# Altium schematic sheet Voltage_Rails.SchDoc
size A; SheetNumber: 2; SheetTotal: 5
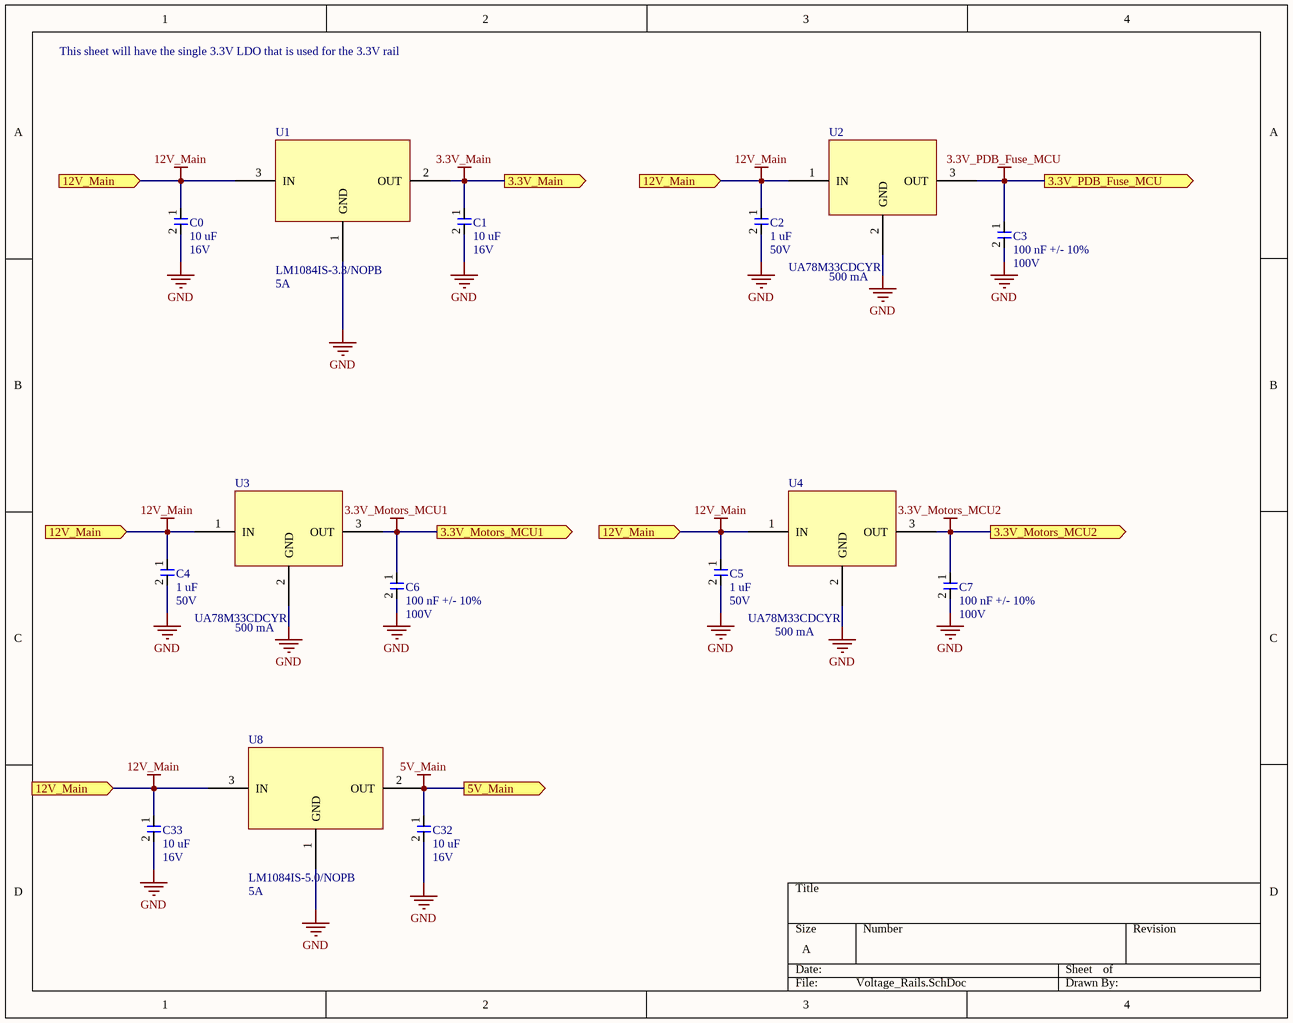
[diagram p0: Voltage_Rails.SchDoc]

## Parts
C0  Capacitance: 10 uF  Voltage Rating: 16V  [CAP-0805]  (hidden comment: CL21A106KOQNNNE)
C1  Capacitance: 10 uF  Voltage Rating: 16V  [CAP-0805]  (hidden comment: CL21A106KOQNNNE)
C2  Capacitance: 1 uF  Voltage: 50V  [CAP-0603]  (hidden comment: UMK107AB7105KA-T)
C3  Capacitance: 100 nF +/- 10%  Voltage: 100V  [CAP-0603]  (hidden comment: CC0603KRX7R0BB104)
C4  Capacitance: 1 uF  Voltage: 50V  [CAP-0603]  (hidden comment: UMK107AB7105KA-T)
C5  Capacitance: 1 uF  Voltage: 50V  [CAP-0603]  (hidden comment: UMK107AB7105KA-T)
C6  Capacitance: 100 nF +/- 10%  Voltage: 100V  [CAP-0603]  (hidden comment: CC0603KRX7R0BB104)
C7  Capacitance: 100 nF +/- 10%  Voltage: 100V  [CAP-0603]  (hidden comment: CC0603KRX7R0BB104)
C32  Capacitance: 10 uF  Voltage Rating: 16V  [CAP-0805]  (hidden comment: CL21A106KOQNNNE)
C33  Capacitance: 10 uF  Voltage Rating: 16V  [CAP-0805]  (hidden comment: CL21A106KOQNNNE)
U1  LM1084IS-3.3/NOPB  Current: 5A  [DDPAK/TO-263-3]
U2  UA78M33CDCYR  Current: 500 mA  [SOT-223-4]
U3  UA78M33CDCYR  Current: 500 mA  [SOT-223-4]
U4  UA78M33CDCYR  Current: 500 mA  [SOT-223-4]
U8  LM1084IS-5.0/NOPB  Current: 5A  [DDPAK/TO-263-3]

## Ports
3.3V_Main (out), 3.3V_Motors_MCU1 (out), 3.3V_Motors_MCU2 (out), 3.3V_PDB_Fuse_MCU (out), 5V_Main (out), 12V_Main (in)

## Nets
3.3V_Main: C1.1 U1.2(OUT) ; port 3.3V_Main
3.3V_Motors_MCU1: C6.1 U3.3(OUT) ; port 3.3V_Motors_MCU1
3.3V_Motors_MCU2: C7.1 U4.3(OUT) ; port 3.3V_Motors_MCU2
3.3V_PDB_Fuse_MCU: C3.1 U2.3(OUT) ; port 3.3V_PDB_Fuse_MCU
5V_Main: C32.1 U8.2(OUT) ; port 5V_Main
12V_Main: C0.1 C2.1 C4.1 C5.1 C33.1 U1.3(IN) U2.1(IN) U3.1(IN) U4.1(IN) U8.3(IN) ; port 12V_Main
GND: C0.2 C1.2 C2.2 C3.2 C4.2 C5.2 C6.2 C7.2 C32.2 C33.2 U1.1(GND) U2.2(GND) U3.2(GND) U4.2(GND) U8.1(GND)

## Notes on the sheet
- This sheet will have the single 3.3V LDO that is used for the 3.3V rail

## Library data of the parts
C0 C1 C32 C33 = CAP-10U-0002: 10 µF ±10% 16V Ceramic Capacitor X7R 0805 (2012 Metric); Package Size: 0805
C2 C4 C5 = CAP-1U-0002: 1 µF ±10% 50V Ceramic Capacitor X7R 0603 (1608 Metric); Package Size: 0603
C3 C6 C7 = CAP-100N-0002-JLC: 100V 100nF X7R ±10% 0603 Multilayer Ceramic Capacitors MLCC - SMD/SMT ROHS; assembled?: yes; JLC Part Number: C113803
U1 = LDO-3.3V-0001: Linear Voltage Regulator IC Positive Fixed 1 Output 5A DDPAK/TO-263-3; Vout (fixed): 3.3V; Vin (max): 27V; Package: DDPAK/TO-263-3
U2-U4 = LDO-3.3V-0002: Linear Voltage Regulator IC Positive Fixed 1 Output 500mA SOT-223-4; Vin: 25V; Vout: 3.3V; Package: SOT-223-4
U8 = LDO-5V-0001: Linear Voltage Regulator IC Positive Fixed 1 Output 5A DDPAK/TO-263-3; VIn: 25V; Vout: 5V; Package: DDPAK/TO-263-3